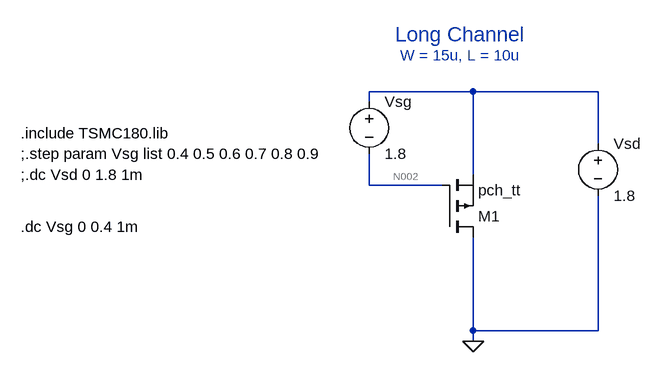
[diagram p0: schematic Q4_pmos_lc.asc]
Q4_pmos_lc.asc, the LTspice schematic file:
Version 4
SHEET 1 880 680
WIRE 336 0 176 0
WIRE 528 0 336 0
WIRE 176 16 176 0
WIRE 528 80 528 0
WIRE 336 128 336 0
WIRE 176 144 176 96
WIRE 288 144 176 144
WIRE 336 368 336 224
WIRE 528 368 528 160
WIRE 528 368 336 368
WIRE 336 384 336 368
FLAG 336 384 0
SYMBOL voltage 528 64 R0
WINDOW 123 0 0 Left 0
WINDOW 39 0 0 Left 0
SYMATTR InstName Vsd
SYMATTR Value 1.8
SYMBOL pmos 288 224 M180
SYMATTR InstName M1
SYMATTR Value pch_tt
SYMATTR Value2 L = 10u W = 15u
SYMBOL voltage 176 0 R0
WINDOW 123 0 0 Left 0
WINDOW 39 0 0 Left 0
SYMATTR InstName Vsg
SYMATTR Value 1.8
TEXT -360 64 Left 2 !.include TSMC180.lib
TEXT -360 96 Left 2 !;.step param Vsg list 0.4 0.5 0.6 0.7 0.8 0.9
TEXT -360 128 Left 2 !;.dc Vsd 0 1.8 1m
TEXT -360 208 Left 2 !.dc Vsg 0 0.4 1m
TEXT 216 -88 Left 3 ;Long Channel
TEXT 224 -56 Left 2 ;W = 15u, L = 10u

The netlist it stands for:
* Q4_pmos_lc.asc
Vsd N001 0 1.8
M1 0 N002 N001 N001 pch_tt L = 10u W = 15u
Vsg N001 N002 1.8
.model NMOS NMOS
.model PMOS PMOS
.lib standard.mos
.include TSMC180.lib
;.step param Vsg list 0.4 0.5 0.6 0.7 0.8 0.9
;.dc Vsd 0 1.8 1m
.dc Vsg 0 0.4 1m
* Long Channel
* W = 15u, L = 10u
.backanno
.end

* Results of the author's LTspice run, read from the files saved beside the schematic
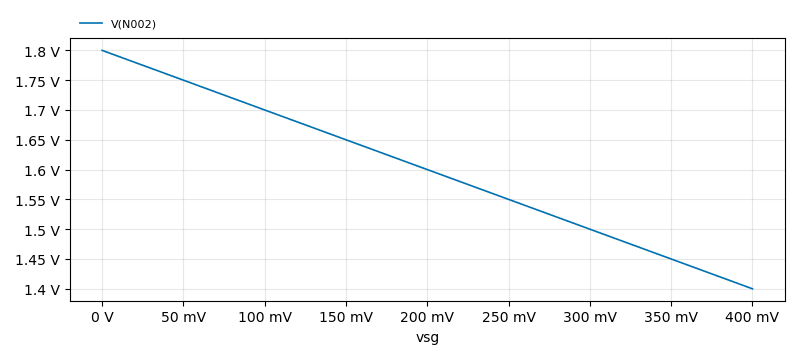
[diagram p1: DC transfer characteristic of Q4_pmos_lc.asc, plotted from the saved traces]
* DC transfer characteristic, 1 run:
*   V(N002): 1.8 V at vsg=0 V, 1.4 V at vsg=400 mV, min 1.4 V, max 1.8 V